# Altium schematic sheet Puissance.SchDoc
size A3; SheetNumber: 1; SheetTotal: 1
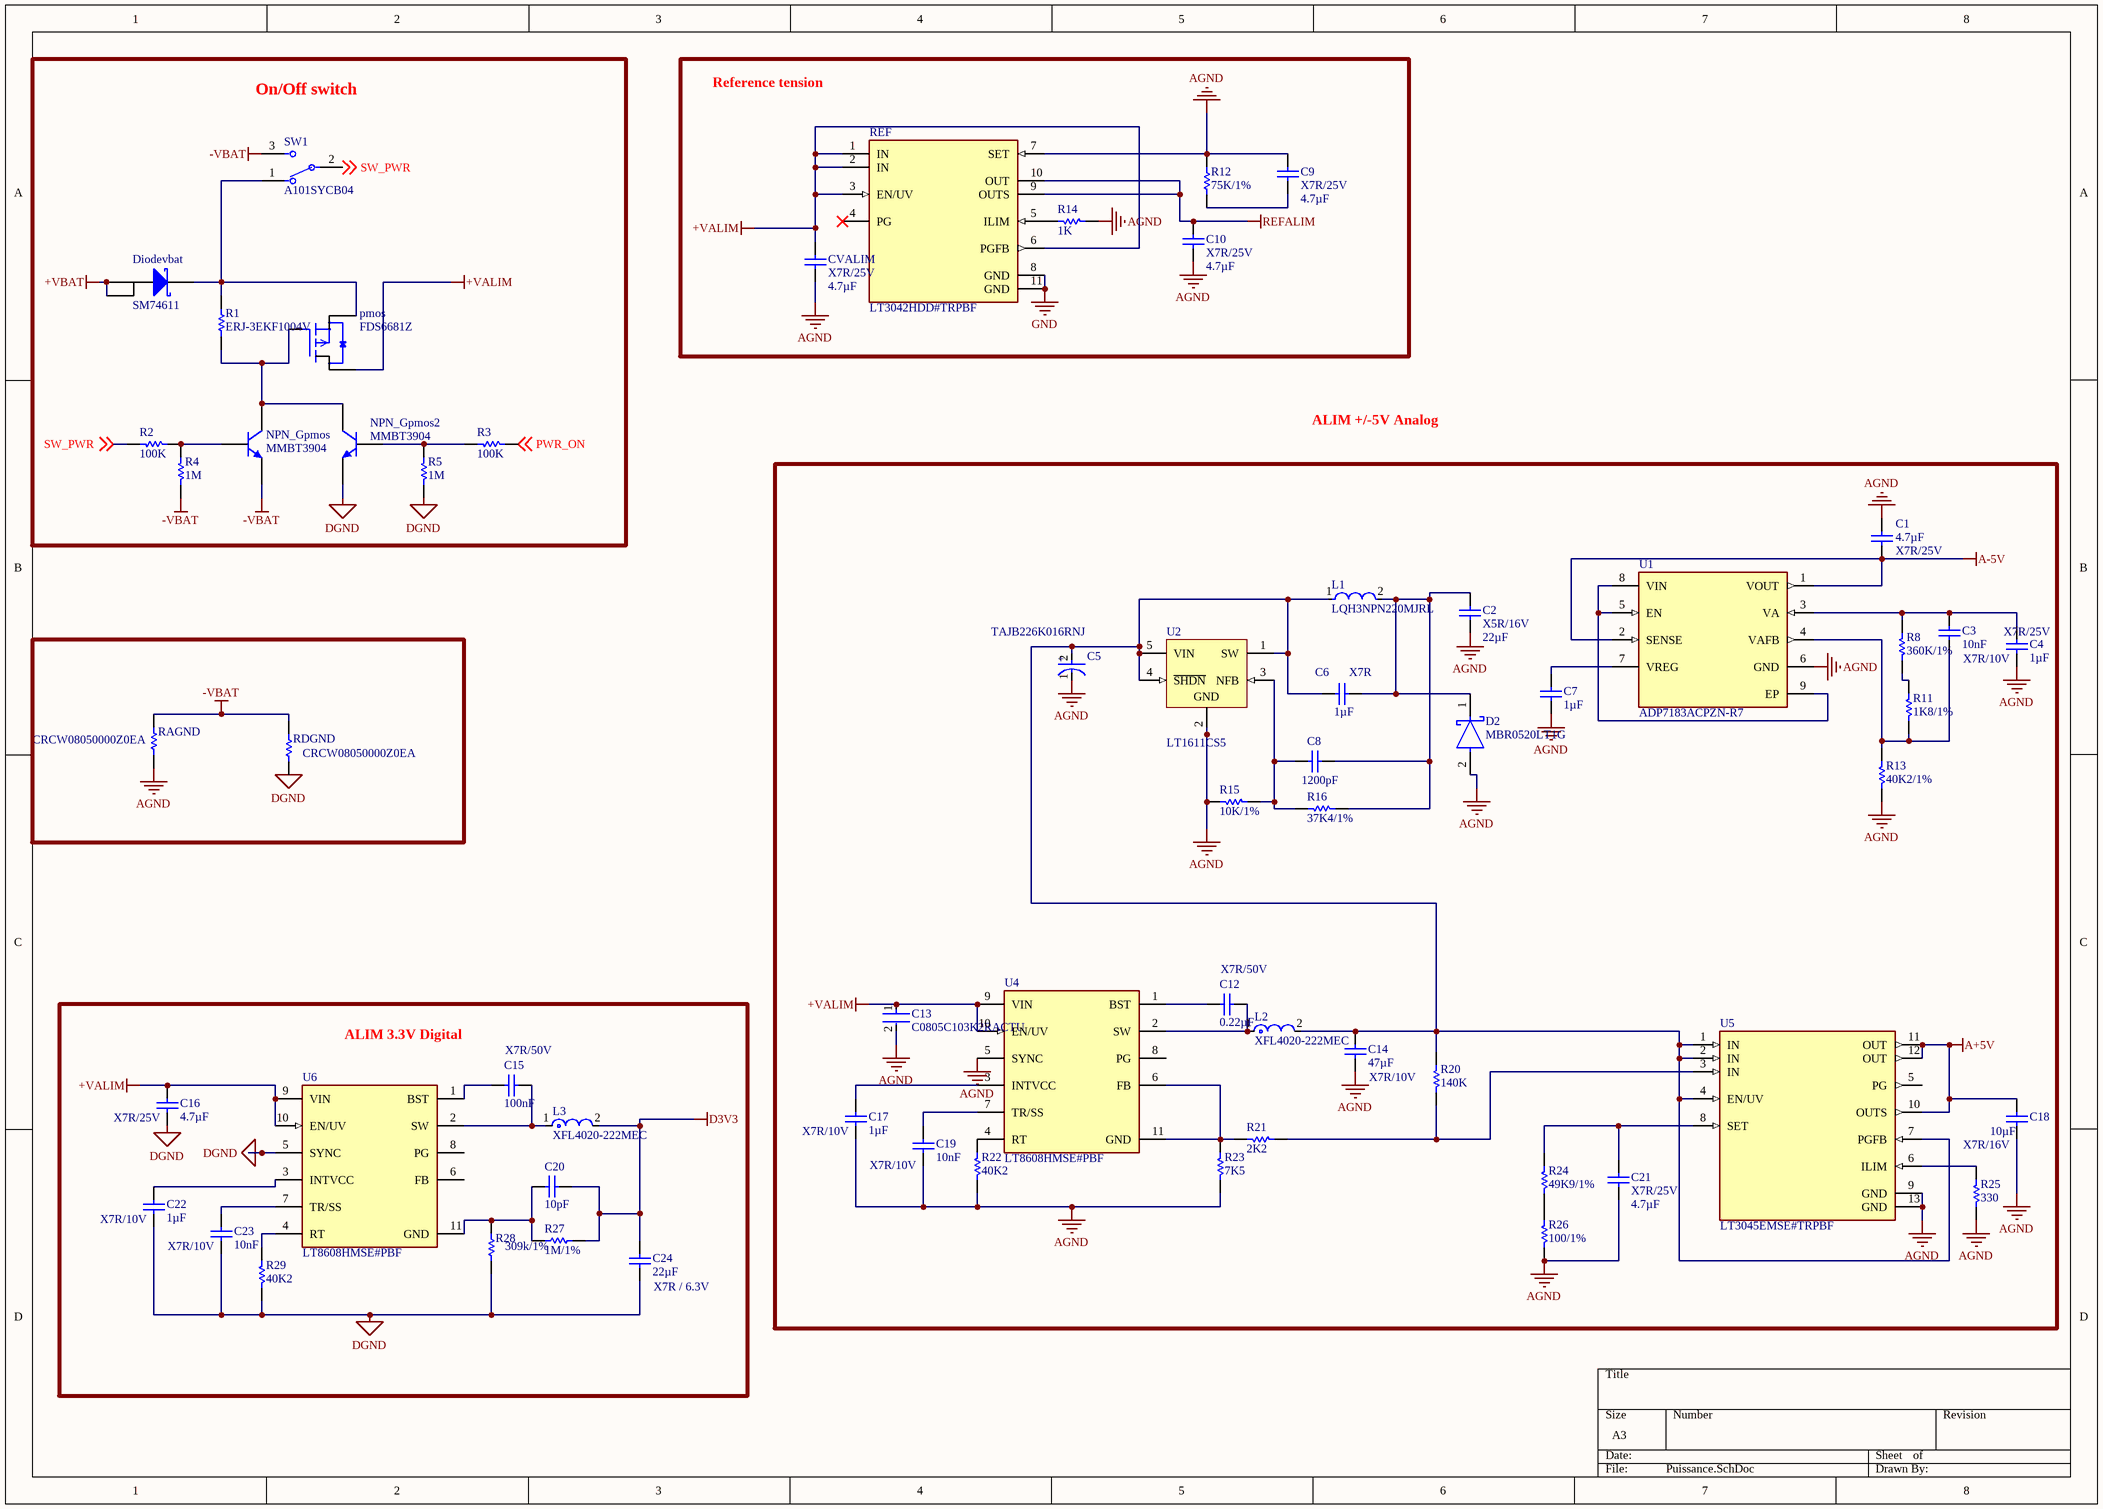
[diagram p0: Puissance.SchDoc]

## Parts
C1  X7R/25V  value 4.7µF  [C1206]
C2  X5R/16V  value 22µF  [C1210]
C3  X7R/10V  value 10nF  [1608[0603]]
C4  X7R/25V  value 1µF  [C0805]
C5  TAJB226K016RNJ  [FP-TAJB-MFG]
C6  X7R  value 1µF  [C0805]
C7  value 1µF  [C0805]  (hidden comment: X7R/25V)
C8  value 1200pF  [1608[0603]]  (hidden comment: X7R/50V)
C9  X7R/25V  value 4.7µF  [C1206]
C10  X7R/25V  value 4.7µF  [C1206]
C12  X7R/50V  value 0.22µF  [C0805]
C13  C0805C103K2RACTU  [FP-C0805C-DN-MFG]
C14  X7R/10V  value 47µF  [C1210]
C15  X7R/50V  value 100nF  [C0805]
C16  X7R/25V  value 4.7µF  [C1206]
C17  X7R/10V  value 1µF  [1608[0603]]
C18  X7R/16V  value 10µF  [C1206]
C19  X7R/10V  value 10nF  [1608[0603]]
C20  value 10pF  [C0805]  (hidden comment: Cap Semi)
C21  X7R/25V  value 4.7µF  [C1206]
C22  X7R/10V  value 1µF  [1608[0603]]
C23  X7R/10V  value 10nF  [1608[0603]]
C24  X7R / 6.3V  value 22µF  [C1210]
CVALIM  X7R/25V  value 4.7µF  [C1206]
D2  MBR0520LT1G  [FP-425-04-IPC_C]
Diodevbat  SM74611  [D2PAK_N]
L1  LQH3NPN220MJRL  [FP-LQH3NPN_JR-MFG]
L2  XFL4020-222MEC  [FP-XFL4020-MFG]
L3  XFL4020-222MEC  [FP-XFL4020-MFG]
NPN_Gpmos  MMBT3904  [SOT-23_N]
NPN_Gpmos2  MMBT3904  [SOT-23_N]
pmos  FDS6681Z  [SO-8]
R1  ERJ-3EKF1004V  [RESC1608X55X30LL15T15]
R2  value 100K  [0603]  (hidden comment: Res CMS)
R3  value 100K  [0603]  (hidden comment: Res CMS)
R4  value 1M  [0603]  (hidden comment: Res CMS)
R5  value 1M  [0603]  (hidden comment: Res CMS)
R8  value 360K/1%  [0603]
R11  value 1K8/1%  [0603]
R12  value 75K/1%  [0603]
R13  value 40K2/1%  [0603]
R14  value 1K  [0603]  (hidden comment: Res CMS)
R15  value 10K/1%  [0603]
R16  value 37K4/1%  [0603]
R20  value 140K  [0603]
R21  value 2K2  [0603]
R22  value 40K2  [0603]
R23  value 7K5  [0603]
R24  value 49K9/1%  [0603]
R25  value 330  [0603]
R26  value 100/1%  [0603]
R27  value 1M/1%  [6-0805_M]  (hidden comment: Res1)
R28  value 309k/1%  [6-0805_M]  (hidden comment: Res1)
R29  value 40K2  [0603]
RAGND  CRCW08050000Z0EA  [RESC2013X50X30LL20T20]
RDGND  CRCW08050000Z0EA  [RESC2013X50X30LL20T20]
REF  LT3042HDD#TRPBF  [FP-DD-10-05-08-1699-IPC_C]
SW1  A101SYCB04  [FP-A101SYCB04-MFG]
U1  ADP7183ACPZN-R7  [FP-CP-8-27-IPC_B]
U2  LT1611CS5  [LT-S5-5-SOT-23_M]
U4  LT8608HMSE#PBF  [FP-MSE-10-05-08-1664-IPC_A]
U5  LT3045EMSE#TRPBF  [FP-MSE-12-05-08-1666-IPC_B]
U6  LT8608HMSE#PBF  [FP-MSE-10-05-08-1664-IPC_A]

## Blocks framed on the sheet
On/Off switch: Diodevbat NPN_Gpmos NPN_Gpmos2 pmos R1-R5 SW1

## Nets
+VALIM: C13.1 C16.2 CVALIM.1 pmos.8(D@4) REF.1(IN) REF.2(IN) REF.3(EN/UV) REF.6(PGFB) U4.9(VIN) U4.10(EN/UV) U6.9(VIN) U6.10(EN/UV)
+VBAT: Diodevbat.1(A) Diodevbat.3(A)
-VBAT: NPN_Gpmos.2(E) R4.2 RAGND.2 RDGND.2 SW1.3
A+5V: C18.1 U5.10(OUTS) U5.11(OUT) U5.12(OUT)
A-5V: C1.1 U1.1(VOUT) U1.2(SENSE)
AGND: C1.2 C2.2 C4.1 C5.1(C) C7.1 C9.1 C10.2 C13.2 C14.2 C17.1 C18.2 C19.1 C21.1 CVALIM.2 D2.2(A) R12.2 R13.2 R14.2 R15.1 R22.2 R23.2 R25.2 R26.2 RAGND.1 REF.7(SET) U1.6(GND) U2.2(GND) U4.5(SYNC) U5.9(GND) U5.13(GND)
D3V3: C20.2 C24.1 L3.2 R27.1
DGND: C16.1 C22.1 C23.1 C24.2 NPN_Gpmos2.2(E) R5.2 R28.1 R29.2 U6.5(SYNC)
GND: REF.8(GND) REF.11(GND)
REFALIM: C10.1 REF.9(OUTS) REF.10(OUT)
PWR_ON: R3.2 ; off-sheet PWR_ON
SW_PWR: R2.1 SW1.2 ; off-sheet SW_PWR
NetC2_1: C2.1 C6.1 C8.1 D2.1(C) L1.2 R16.2
NetC3_1: C3.1 R11.2 R13.1 U1.4(VAFB)
NetC3_2: C3.2 C4.2 R8.1 U1.3(VA)
NetC5_2: C5.2(A) C6.2 C14.1 L1.1 L2.2 R20.1 U2.1(SW) U2.4(~{SHDN}) U2.5(VIN) U5.1(IN) U5.2(IN) U5.4(EN/UV) U5.7(PGFB)
NetC7_2: C7.2 U1.7(VREG)
NetC8_2: C8.2 R15.2 R16.1 U2.3(NFB)
NetC9_2: C9.2 R12.1
NetC12_1: C12.1 U4.1(BST)
NetC12_2: C12.2 L2.1 U4.2(SW)
NetC15_1: C15.1 U6.1(BST)
NetC15_2: C15.2 L3.1 U6.2(SW)
NetC17_2: C17.2 U4.3(INTVCC)
NetC19_2: C19.2 U4.7(TR/SS)
NetC20_1: C20.1 R27.2 R28.2 U6.11(GND)
NetC21_2: C21.2 R24.1 U5.8(SET)
NetC22_2: C22.2 U6.3(INTVCC)
NetC23_2: C23.2 U6.7(TR/SS)
NetDiodevbat_2: Diodevbat.2(K) pmos.3(S@3) R1.2 SW1.1
NetNPN_Gpmos2_1: NPN_Gpmos2.1(B) R3.1 R5.1
NetNPN_Gpmos_1: NPN_Gpmos.1(B) R2.2 R4.1
NetNPN_Gpmos_3: NPN_Gpmos.3(C) NPN_Gpmos2.3(C) pmos.4(G) R1.1
NetR8_2: R8.2 R11.1
NetR14_1: R14.1 REF.5(ILIM)
NetR20_2: R20.2 R21.2 U5.3(IN)
NetR21_1: R21.1 R23.1 U4.6(FB) U4.11(GND)
NetR22_1: R22.1 U4.4(RT)
NetR24_2: R24.2 R26.1
NetR25_1: R25.1 U5.6(ILIM)
NetR29_1: R29.1 U6.4(RT)
NetU1_5: U1.5(EN) U1.8(VIN) U1.9(EP)

Not connected (* = marked no-connect by the designer): pmos 1(S@1) 2(S@2) 5(D@1) 6(D@2) 7(D@3); RDGND 1; REF 4(PG)*; U4 8(PG); U5 5(PG); U6 6(FB) 8(PG)

## Notes on the sheet
- (near REF) Reference tension
- ALIM +/-5V Analog
- ALIM 3.3V Digital
- Labels drawn without touching a wire or pin: DGND
- (in symbol CMP-2100-03689-2) +

## Library data of the parts
C1-C4 C6-C10 C12 C14-C24 CVALIM = Cap Semi: Capacitor (Semiconductor SIM Model); Published: 8-Jun-2000; LatestRevisionDate: 29-May-2009; LatestRevisionNote: IPC-7351 Footprint Added.; PackageReference: C1206; Publisher: Altium Limited; PackageDescription: Chip Capacitor
C5 = CMP-2100-03689-2: 22uF 16V  ±10% 2.3Ω 1210  SMD Tantalum Capacitor; Leakage Current: 3.5uA; ESR (Equivalent Series Resistance): 2.3R; Dissipation Factor: 6%; Polarity: Polar; Series: TAJ; Termination: SMD/SMT; Voltage: 16V; Max Operating Temperature: 125°C; Height - Seated (Max): 0.083inch; Height: 1.9mm; Packaging: Tape and Reel; Voltage Rating: 16V; Features: General Purpose; Tolerance: 10%; Construction: Flat; Lead Free: Lead Free; Width: 2.8mm; REACH SVHC: No SVHC; Capacitance: 22uF; Length: 3.5mm; Mount: Surface Mount; Depth: 2.8mm; Voltage Rating (DC): 16V; Case/Package: 1210; Case Code (Metric): 3528; Package Quantity: 1; Radiation Hardening: No; Min Operating Temperature: -55°C; Number of Pins: 2; RoHS Compliant: Yes; Dielectric Material: Tantalum; Case Code (Imperial): 1210
C13 = CMP-2007-00259-2: CAP CER 10000PF 200V X7R 0805; Manufacturer: KEMET; Material: Ceramic; Temperature Coefficient: 30ppm/°C; Capacitance: 10,000 pF; Tolerance: 0.1; Value: 10,000 pF; Device Class L2: Capacitors; Voltage Rating: 200 V; Temperature Range High: +125°C; ComponentLink2Description: Datasheet; Height: 0.88mm; Octopart: https://octopart.com/c0805c103k2ractu-kemet-9138347; ComponentLink2URL: https://content.kemet.com/datasheets/KEM_C1003_C0G_SMD.pdf; Category: Cap; Temperature: -55°C to +125°C; Temperature Range Low: -55°C; Digikey Description: CAP CER 10000PF 200V X7R 0805; Manufacturer Part Number: C0805C103K2RACTU; Temperature Characteristic: X7R; Automotive: No; Device Class L3: Ceramic Capacitors; Mouser Description: KEMET - C0805C103K2RACTU - CAP, MLCC, X7R, 10NF, 200V, 0805; RoHS: TRUE; Device Class L1: Passive Components; Lead Free: Yes; Package: C0805C-DN; Ipc Land Pattern Name: CAPC200125X78
D2 = CMP-1055-00425-2: DIODE SCHOTTKY 20V 500MA SOD123; Polarity: Standard; Peak Non-Repetitive Surge Current: 5.5A; Forward Voltage: 385mV; Element Configuration: Single; Peak Reverse Current: 250uA; Max Repetitive Reverse Voltage (Vrrm): 20V; Voltage Rating (DC): 20V; Case/Package: SOD-123-2; Number of Pins: 2; Output Current: 500mA; Min Operating Temperature: -65°C; Lead Free: Lead Free; REACH SVHC: No SVHC; Max Reverse Voltage (DC): 20V; Termination: SMD/SMT; Average Rectified Current: 500mA; Max Surge Current: 5.5A; Package Quantity: 3000; Height: 1.12mm; Current Rating: 500mA; Forward Current: 500mA; Max Forward Surge Current (Ifsm): 5.5A; Packaging: Tape and Reel; Length: 2.69mm; Radiation Hardening: No; Max Reverse Leakage Current: 250uA; Width: 1.6mm; Contact Plating: Tin; Max Operating Temperature: 125°C
Diodevbat = SM74611: Smart Schottky
L1 = CMP-06042-011801-1: Wire Wound Ferrite Inductor for Power Lines 22μH ±20% 0.6Ω 800mA 1212; Max DC Current: 520mA; DC Resistance (DCR): 600mR; Self Resonant Frequency: 20MHz; Current Rating: 350mA; Inductance: 22uH; Test Frequency: 1MHz; Shielding: Shielded; Min Operating Temperature: -40°C; Tolerance: 20%; Case/Package: 1212; Max Operating Temperature: 105°C; Package Quantity: 2000; Saturation Current: 520mA; Length: 0.118inch; Case Code (Metric): 3030; Width: 0.118inch; Case Code (Imperial): 1212; Height - Seated (Max): 0.047inch; Termination: SMD/SMT; Packaging: Tape and Reel; Weight: 0.001799oz; Resistor Type: Wirewound; Height: 0.9mm; Core Material: Ferrite; Mount: Surface Mount
L2 L3 = CMP-2000-05090-4: INDUCTOR, 2.2UH, 8A, 20%, 38MHZ, REEL; Test Frequency: 100kHz; Shielding: Shielded; Saturation Current: 3.1A; DC Resistance (DCR): 23.5mR; Core Material: Composite; Height: 2.1mm; Width: 4.3mm; Mount: Surface Mount; RMS Current (Irms): 8A; Case/Package: SMD/SMT; Length: 4.3mm; REACH SVHC: No SVHC; Max DC Current: 8A; Min Operating Temperature: -40°C; Series: XFL4020; Self Resonant Frequency: 38MHz; Inductance Tolerance: 20%; Lead Free: Contains Lead; Tolerance: 20%; RoHS Compliant: Yes; Termination: SMD/SMT; Packaging: Tape and Reel; Max Operating Temperature: 125°C; Inductance: 2.2uH
NPN_Gpmos NPN_Gpmos2 = MMBT3904: NPN
pmos = FDS6681Z: P-Channel 30V 20A _Ta_ 2.5W _Ta_ Surface Mount 8-SOIC; MF: ON Semiconductor; Value: *; MP: FDS6681Z; SnapEDA_Link: https://www.snapeda.com/parts/FDS6681Z/ON%20Semiconductor/view-part/1803759/?ref=snap; Availability: Unavailable; Package: SO-8 ON Semiconductor; Price: None
R1 = CMP-1012-00849-2: Manufacturer: Panasonic; Part Number: ERJ-3EKF1004V
R2-R5 R8 R11-R16 R20-R26 R29 = Res CMS: Resistor; Published: 8-Jun-2000; LatestRevisionDate: 17-Jul-2002; LatestRevisionNote: Re-released for DXP Platform.; PackageReference: AXIAL-0.3; Publisher: Altium Limited; PackageDescription: Axial Device, Thru-Hole; 2 Leads; 0.3 in Pin Spacing
R27 R28 = Res1: Resistor; Published: 8-Jun-2000; LatestRevisionDate: 17-Jul-2002; LatestRevisionNote: Re-released for DXP Platform.; PackageReference: AXIAL-0.3; Publisher: Altium Limited; PackageDescription: Axial Device, Thru-Hole; 2 Leads; 0.3 in Pin Spacing
RAGND RDGND = CMP-2001-04896-1: Manufacturer: Vishay Dale; Part Number: CRCW08050000Z0EA
REF = CMP-09138-000070-1: IC REG LIN POS ADJ 200MA 10DFN; Number of Regulators: 1; Min Current Limit: 220mA; Output Voltage: 15V; Dropout Voltage: 350mV; Mount: Surface Mount; Packaging: Tape and Reel; Number of Pins: 10; Min Operating Temperature: -40°C; Output Current: 200mA; Max Operating Temperature: 150°C; Case/Package: DFN; RoHS Compliant: Yes
SW1 = CMP-03408-000017-1: SWITCH TOGGLE SPDT 0.4VA 20V; Electrical Life: 6000Cycles; Number of Poles: 1; Power Rating: 400mW; Switch Function: On-On; Contact Resistance: 10mR; Contact Current Rating: 400mA; Actuator Material: Phenolic; Insulation Resistance: 30MR; Actuator Color: Chrome; Number of Positions: 2; Actuator Type: Standard Round; Actuator Length: 10.41mm; Illumination Type: Non-Illuminated; Flammability Rating: UL94 V-1; Contact Material: Copper; Depth: 6.86mm; Contact Plating: Gold; Voltage Rating (AC): 20V; Max Voltage Rating (DC): 20V; Min Operating Temperature: -30°C; Max Operating Temperature: 85°C; Throw Configuration: SPDT; Packaging: Bulk; Termination: PC Pins; Series: Gemini A; ELV: Compliant; Lead Free: Lead Free; RoHS Compliant: Yes; REACH SVHC: No SVHC; Mount: Panel; Orientation: Straight; Package Quantity: 100; Max Voltage Rating (AC): 20V; Radiation Hardening: No; Voltage Rating (DC): 20V
U1 = CMP-09138-000168-1: IC REG LIN NEG ADJ 300MA 8LFCSP; Min Output Voltage: -500mV; Max Input Voltage: -5.5V; Output Configuration: Negative; Power Supply Rejection Ratio (PSRR): 40dB; Max Output Voltage: -5V; Max Supply Current: 7mA; Number of Regulators: 1; Quiescent Current: 900uA; Dropout Voltage: 220mV; Output Type: Adjustable; Min Operating Temperature: -40°C; Number of Pins: 8; RoHS Compliant: Yes; Output Current: 300mA; Max Operating Temperature: 125°C; Packaging: Cut Tape; Lead Free: Contains Lead; Mount: Surface Mount
U2 = CMP-0491-01517-1: Inverting 1.4 MHz Switching Regulator, 5-pin SOT23 (S5-5), 0 to 70 degC; Manufacturer: Linear Technology; Number of Outputs: 1; ComponentLink1Description: Manufacturer URL; ComponentLink3Description: Package Specification; ComponentLink1URL: http://www.linear.com/; ComponentLink2Description: Datasheet; PackageVersion: Aug-07; PartNumber: LT1611CS5; ComponentLink3URL: http://cds.linear.com/docs/en/datasheet/17278fb.pdf; PackageDescription: 5-Pin Plastic SOT-23, Body 1.625 x 2.90 mm, Pitch 0.95 mm; Mounting Technology: Surface Mount; ComponentLink2URL: http://cds.linear.com/docs/en/datasheet/1611f.pdf; RoHS: FALSE; PackageReference: S5-5
U4 U6 = CMP-09139-000131-1: IC REG BUCK ADJ 1.5A 10MSOP; RoHS Compliant: Yes; Number of Pins: 10
U5 = CMP-09138-000053-1: IC REG LINEAR 0V 500MA 12MSOP; Case/Package: MSOP; RoHS Compliant: Yes